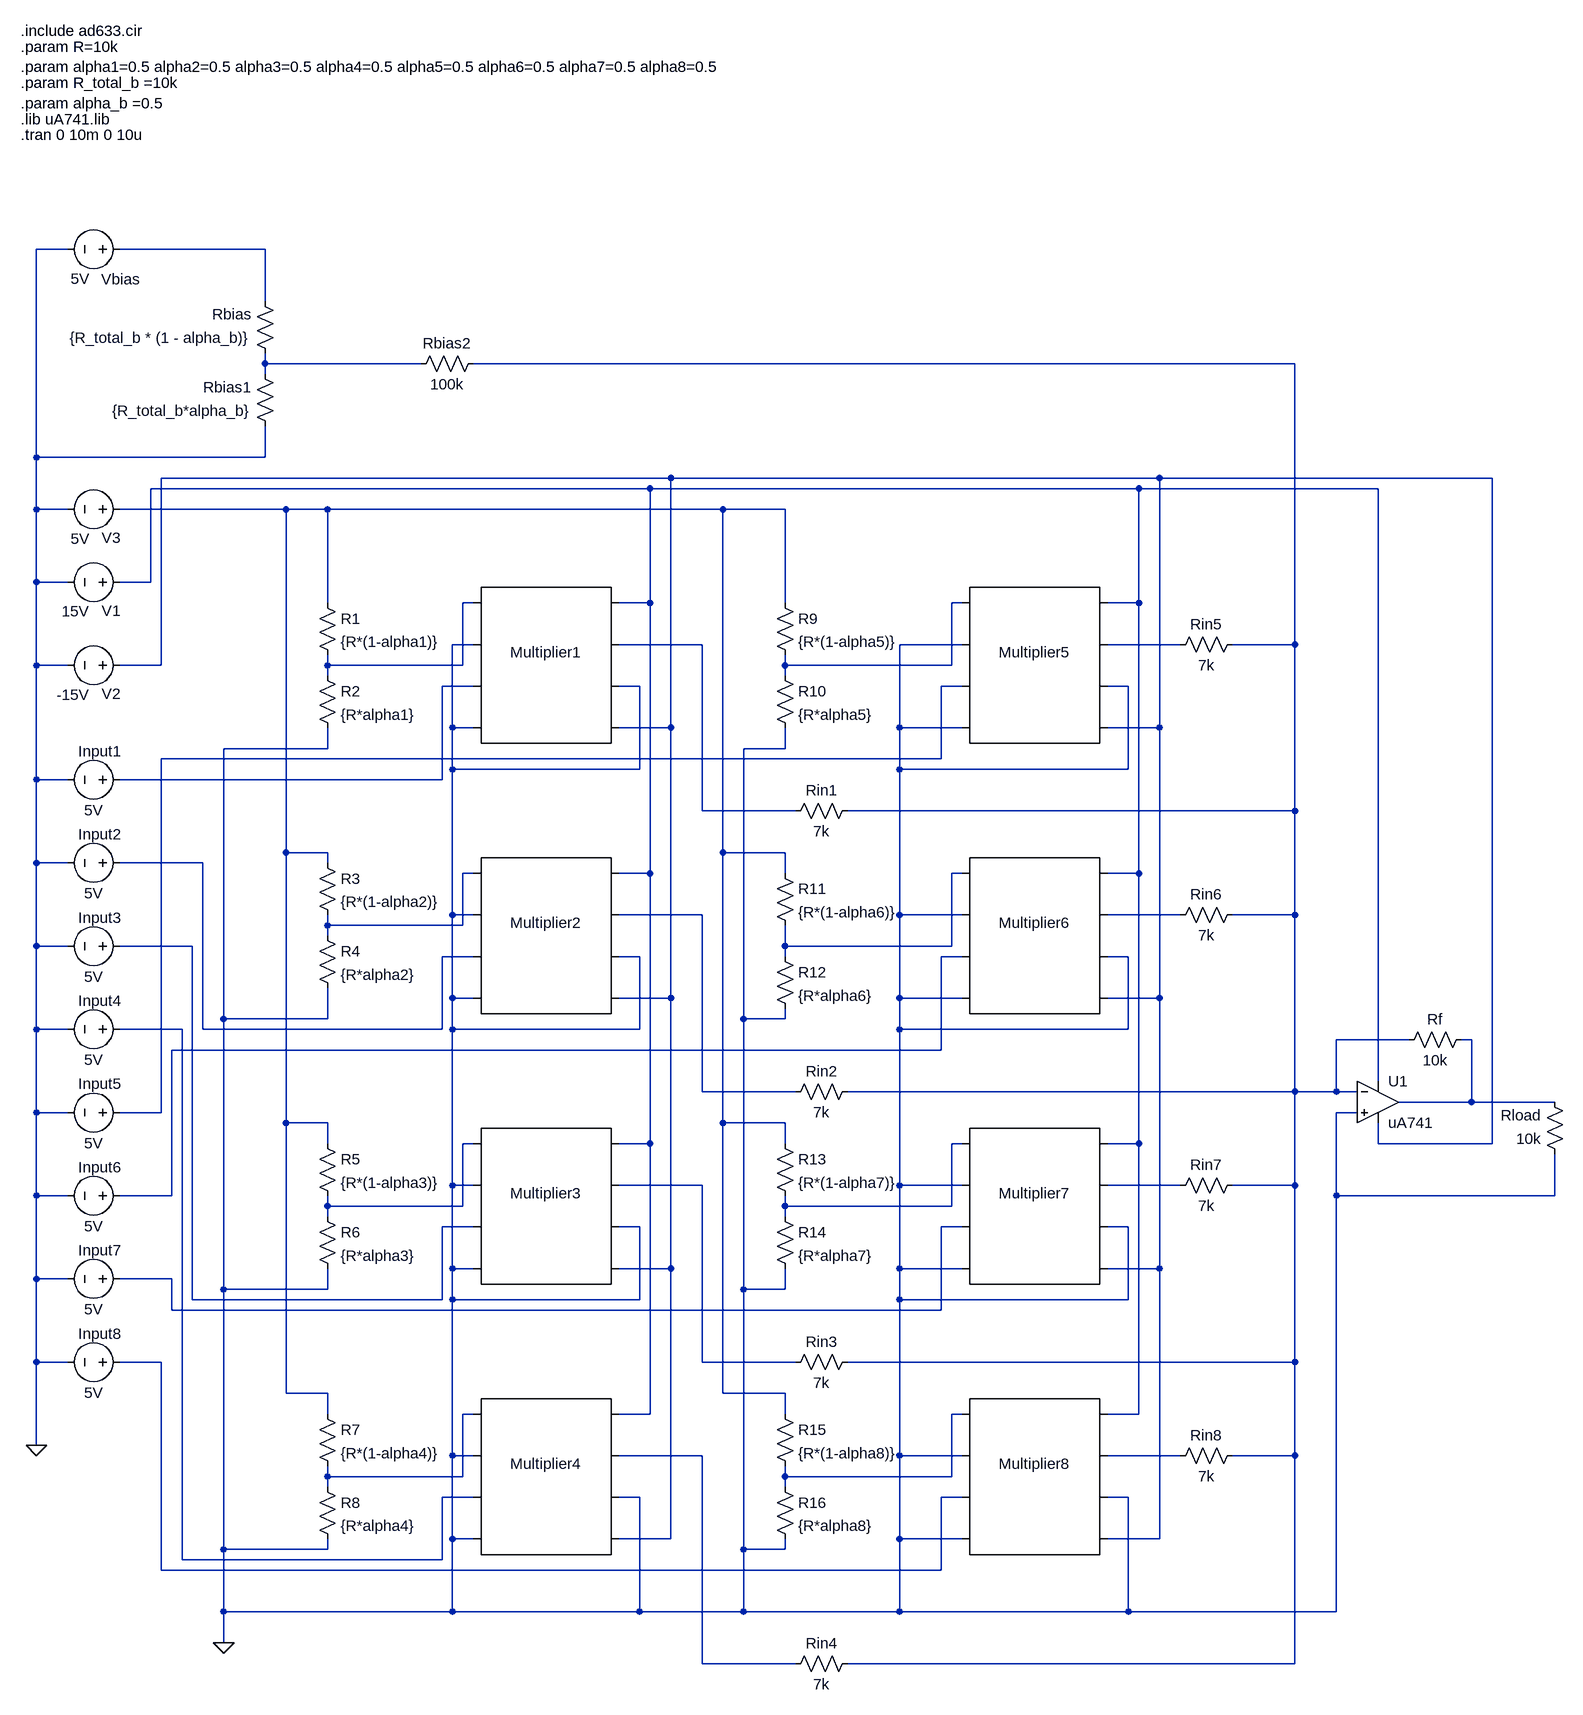
[diagram p0: schematic NMcircuit.asc]
NMcircuit.asc, the LTspice schematic file:
Version 4
SHEET 1 2036 1800
WIRE -272 -448 -320 -448
WIRE 32 -448 -192 -448
WIRE 32 -368 32 -448
WIRE 32 -272 32 -288
WIRE 272 -272 32 -272
WIRE 1616 -272 352 -272
WIRE 32 -256 32 -272
WIRE -320 -128 -320 -448
WIRE 32 -128 32 -176
WIRE 32 -128 -320 -128
WIRE 656 -96 -128 -96
WIRE 1408 -96 656 -96
WIRE 1920 -96 1408 -96
WIRE 624 -80 -144 -80
WIRE 1376 -80 624 -80
WIRE 1744 -80 1376 -80
WIRE -320 -48 -320 -128
WIRE -272 -48 -320 -48
WIRE 64 -48 -192 -48
WIRE 128 -48 64 -48
WIRE 736 -48 128 -48
WIRE 832 -48 736 -48
WIRE -320 64 -320 -48
WIRE -272 64 -320 64
WIRE -144 64 -144 -80
WIRE -144 64 -192 64
WIRE 128 96 128 -48
WIRE 352 96 336 96
WIRE 624 96 624 -80
WIRE 624 96 576 96
WIRE 832 96 832 -48
WIRE 1104 96 1088 96
WIRE 1376 96 1376 -80
WIRE 1376 96 1328 96
WIRE 352 160 320 160
WIRE 704 160 576 160
WIRE 1104 160 1008 160
WIRE 1440 160 1328 160
WIRE 1616 160 1616 -272
WIRE 1616 160 1520 160
WIRE -320 192 -320 64
WIRE -272 192 -320 192
WIRE -128 192 -128 -96
WIRE -128 192 -192 192
WIRE 128 192 128 176
WIRE 336 192 336 96
WIRE 336 192 128 192
WIRE 832 192 832 176
WIRE 1088 192 1088 96
WIRE 1088 192 832 192
WIRE 128 208 128 192
WIRE 832 208 832 192
WIRE 352 224 304 224
WIRE 608 224 576 224
WIRE 1104 224 1072 224
WIRE 1360 224 1328 224
WIRE 320 288 320 160
WIRE 352 288 320 288
WIRE 656 288 656 -96
WIRE 656 288 576 288
WIRE 1008 288 1008 160
WIRE 1104 288 1008 288
WIRE 1408 288 1408 -96
WIRE 1408 288 1328 288
WIRE 128 320 128 288
WIRE 128 320 -32 320
WIRE 832 320 832 288
WIRE 832 320 768 320
WIRE 1072 336 1072 224
WIRE 1072 336 -128 336
WIRE 320 352 320 288
WIRE 608 352 608 224
WIRE 608 352 320 352
WIRE 1008 352 1008 288
WIRE 1360 352 1360 224
WIRE 1360 352 1008 352
WIRE -320 368 -320 192
WIRE -272 368 -320 368
WIRE 304 368 304 224
WIRE 304 368 -192 368
WIRE 704 416 704 160
WIRE 848 416 704 416
WIRE 1616 416 1616 160
WIRE 1616 416 928 416
WIRE 64 480 64 -48
WIRE 128 480 64 480
WIRE 736 480 736 -48
WIRE 832 480 736 480
WIRE -320 496 -320 368
WIRE -272 496 -320 496
WIRE -64 496 -192 496
WIRE 128 496 128 480
WIRE 352 512 336 512
WIRE 624 512 624 96
WIRE 624 512 576 512
WIRE 832 512 832 480
WIRE 1104 512 1088 512
WIRE 1376 512 1376 96
WIRE 1376 512 1328 512
WIRE 320 576 320 352
WIRE 352 576 320 576
WIRE 704 576 576 576
WIRE 1008 576 1008 352
WIRE 1104 576 1008 576
WIRE 1440 576 1328 576
WIRE 1616 576 1616 416
WIRE 1616 576 1520 576
WIRE 128 592 128 576
WIRE 336 592 336 512
WIRE 336 592 128 592
WIRE 128 608 128 592
WIRE -320 624 -320 496
WIRE -272 624 -320 624
WIRE -80 624 -192 624
WIRE 832 624 832 592
WIRE 1088 624 1088 512
WIRE 1088 624 832 624
WIRE 352 640 304 640
WIRE 608 640 576 640
WIRE 832 640 832 624
WIRE 1104 640 1072 640
WIRE 1360 640 1328 640
WIRE 320 704 320 576
WIRE 352 704 320 704
WIRE 656 704 656 288
WIRE 656 704 576 704
WIRE 1008 704 1008 576
WIRE 1104 704 1008 704
WIRE 1408 704 1408 288
WIRE 1408 704 1328 704
WIRE -32 736 -32 320
WIRE 128 736 128 688
WIRE 128 736 -32 736
WIRE 768 736 768 320
WIRE 832 736 832 720
WIRE 832 736 768 736
WIRE -320 752 -320 624
WIRE -272 752 -320 752
WIRE -96 752 -192 752
WIRE -64 752 -64 496
WIRE 304 752 304 640
WIRE 304 752 -64 752
WIRE 320 752 320 704
WIRE 608 752 608 640
WIRE 608 752 320 752
WIRE 1008 752 1008 704
WIRE 1360 752 1360 640
WIRE 1360 752 1008 752
WIRE 1792 768 1680 768
WIRE 1888 768 1872 768
WIRE 1072 784 1072 640
WIRE 1072 784 -112 784
WIRE 1744 832 1744 -80
WIRE 704 848 704 576
WIRE 848 848 704 848
WIRE 1616 848 1616 576
WIRE 1616 848 928 848
WIRE 1680 848 1680 768
WIRE 1680 848 1616 848
WIRE 1712 848 1680 848
WIRE 1888 864 1888 768
WIRE 1888 864 1776 864
WIRE 2016 864 1888 864
WIRE -320 880 -320 752
WIRE -272 880 -320 880
WIRE -128 880 -128 336
WIRE -128 880 -192 880
WIRE 1712 880 1680 880
WIRE 64 896 64 480
WIRE 128 896 64 896
WIRE 736 896 736 480
WIRE 832 896 736 896
WIRE 128 928 128 896
WIRE 352 928 336 928
WIRE 624 928 624 512
WIRE 624 928 576 928
WIRE 832 928 832 896
WIRE 1104 928 1088 928
WIRE 1376 928 1376 512
WIRE 1376 928 1328 928
WIRE 1744 928 1744 896
WIRE 1920 928 1920 -96
WIRE 1920 928 1744 928
WIRE 320 992 320 752
WIRE 352 992 320 992
WIRE 704 992 576 992
WIRE 1008 992 1008 752
WIRE 1104 992 1008 992
WIRE 1440 992 1328 992
WIRE 1616 992 1616 848
WIRE 1616 992 1520 992
WIRE -320 1008 -320 880
WIRE -272 1008 -320 1008
WIRE -112 1008 -112 784
WIRE -112 1008 -192 1008
WIRE 1680 1008 1680 880
WIRE 2016 1008 2016 944
WIRE 2016 1008 1680 1008
WIRE 128 1024 128 1008
WIRE 336 1024 336 928
WIRE 336 1024 128 1024
WIRE 832 1024 832 1008
WIRE 1088 1024 1088 928
WIRE 1088 1024 832 1024
WIRE 128 1040 128 1024
WIRE 832 1040 832 1024
WIRE 352 1056 304 1056
WIRE 608 1056 576 1056
WIRE 1104 1056 1072 1056
WIRE 1360 1056 1328 1056
WIRE 320 1120 320 992
WIRE 352 1120 320 1120
WIRE 656 1120 656 704
WIRE 656 1120 576 1120
WIRE 1008 1120 1008 992
WIRE 1104 1120 1008 1120
WIRE 1408 1120 1408 704
WIRE 1408 1120 1328 1120
WIRE -320 1136 -320 1008
WIRE -272 1136 -320 1136
WIRE -112 1136 -192 1136
WIRE -32 1152 -32 736
WIRE 128 1152 128 1120
WIRE 128 1152 -32 1152
WIRE 768 1152 768 736
WIRE 832 1152 832 1120
WIRE 832 1152 768 1152
WIRE -80 1168 -80 624
WIRE 304 1168 304 1056
WIRE 304 1168 -80 1168
WIRE 320 1168 320 1120
WIRE 608 1168 608 1056
WIRE 608 1168 320 1168
WIRE 1008 1168 1008 1120
WIRE 1360 1168 1360 1056
WIRE 1360 1168 1008 1168
WIRE -112 1184 -112 1136
WIRE 1072 1184 1072 1056
WIRE 1072 1184 -112 1184
WIRE -320 1264 -320 1136
WIRE -272 1264 -320 1264
WIRE -128 1264 -192 1264
WIRE 704 1264 704 992
WIRE 848 1264 704 1264
WIRE 1616 1264 1616 992
WIRE 1616 1264 928 1264
WIRE 64 1312 64 896
WIRE 128 1312 64 1312
WIRE 736 1312 736 896
WIRE 832 1312 736 1312
WIRE 128 1344 128 1312
WIRE 352 1344 336 1344
WIRE 624 1344 624 928
WIRE 624 1344 576 1344
WIRE 832 1344 832 1312
WIRE 1104 1344 1088 1344
WIRE 1376 1344 1376 928
WIRE 1376 1344 1328 1344
WIRE -320 1392 -320 1264
WIRE 320 1408 320 1168
WIRE 352 1408 320 1408
WIRE 704 1408 576 1408
WIRE 1008 1408 1008 1168
WIRE 1104 1408 1008 1408
WIRE 1440 1408 1328 1408
WIRE 1616 1408 1616 1264
WIRE 1616 1408 1520 1408
WIRE 128 1440 128 1424
WIRE 336 1440 336 1344
WIRE 336 1440 128 1440
WIRE 832 1440 832 1424
WIRE 1088 1440 1088 1344
WIRE 1088 1440 832 1440
WIRE 128 1456 128 1440
WIRE 832 1456 832 1440
WIRE 352 1472 304 1472
WIRE 608 1472 576 1472
WIRE 1104 1472 1072 1472
WIRE 1360 1472 1328 1472
WIRE 320 1536 320 1408
WIRE 352 1536 320 1536
WIRE 656 1536 656 1120
WIRE 656 1536 576 1536
WIRE 1008 1536 1008 1408
WIRE 1104 1536 1008 1536
WIRE 1408 1536 1408 1120
WIRE 1408 1536 1328 1536
WIRE -32 1552 -32 1152
WIRE 128 1552 128 1536
WIRE 128 1552 -32 1552
WIRE 768 1552 768 1152
WIRE 832 1552 832 1536
WIRE 832 1552 768 1552
WIRE -96 1568 -96 752
WIRE 304 1568 304 1472
WIRE 304 1568 -96 1568
WIRE -128 1584 -128 1264
WIRE 1072 1584 1072 1472
WIRE 1072 1584 -128 1584
WIRE -32 1648 -32 1552
WIRE 320 1648 320 1536
WIRE 320 1648 -32 1648
WIRE 608 1648 608 1472
WIRE 608 1648 320 1648
WIRE 768 1648 768 1552
WIRE 768 1648 608 1648
WIRE 1008 1648 1008 1536
WIRE 1008 1648 768 1648
WIRE 1360 1648 1360 1472
WIRE 1360 1648 1008 1648
WIRE 1680 1648 1680 1008
WIRE 1680 1648 1360 1648
WIRE -32 1696 -32 1648
WIRE 704 1728 704 1408
WIRE 848 1728 704 1728
WIRE 1616 1728 1616 1408
WIRE 1616 1728 928 1728
FLAG -320 1392 0
FLAG -32 1696 0
SYMBOL voltage -176 64 R90
WINDOW 0 44 14 VRight 2
WINDOW 3 45 62 VRight 2
WINDOW 123 0 0 Left 0
WINDOW 39 0 0 Left 0
SYMATTR InstName V1
SYMATTR Value 15V
SYMBOL voltage -176 -48 R90
WINDOW 0 44 14 VRight 2
WINDOW 3 45 62 VRight 2
WINDOW 123 0 0 Left 0
WINDOW 39 0 0 Left 0
SYMATTR InstName V3
SYMATTR Value 5V
SYMBOL Misc\\DIP8 464 192 R0
SYMATTR InstName Multiplier1
SYMATTR SpiceModel ad633
SYMBOL Misc\\DIP8 464 608 R0
SYMATTR InstName Multiplier2
SYMATTR SpiceModel ad633
SYMBOL Misc\\DIP8 464 1024 R0
SYMATTR InstName Multiplier3
SYMATTR SpiceModel ad633
SYMBOL Misc\\DIP8 464 1440 R0
SYMATTR InstName Multiplier4
SYMATTR SpiceModel ad633
SYMBOL Misc\\DIP8 1216 192 R0
SYMATTR InstName Multiplier5
SYMATTR SpiceModel ad633
SYMBOL Misc\\DIP8 1216 608 R0
SYMATTR InstName Multiplier6
SYMATTR SpiceModel ad633
SYMBOL Misc\\DIP8 1216 1024 R0
SYMATTR InstName Multiplier7
SYMATTR SpiceModel ad633
SYMBOL Misc\\DIP8 1216 1440 R0
SYMATTR InstName Multiplier8
SYMATTR SpiceModel ad633
SYMBOL res 112 80 R0
SYMATTR InstName R1
SYMATTR Value {R*(1-alpha1)}
SYMBOL res 112 192 R0
SYMATTR InstName R2
SYMATTR Value {R*alpha1}
SYMBOL res 112 480 R0
SYMATTR InstName R3
SYMATTR Value {R*(1-alpha2)}
SYMBOL res 112 592 R0
SYMATTR InstName R4
SYMATTR Value {R*alpha2}
SYMBOL res 112 912 R0
SYMATTR InstName R5
SYMATTR Value {R*(1-alpha3)}
SYMBOL res 112 1024 R0
SYMATTR InstName R6
SYMATTR Value {R*alpha3}
SYMBOL res 112 1328 R0
SYMATTR InstName R7
SYMATTR Value {R*(1-alpha4)}
SYMBOL res 112 1440 R0
SYMATTR InstName R8
SYMATTR Value {R*alpha4}
SYMBOL res 816 80 R0
SYMATTR InstName R9
SYMATTR Value {R*(1-alpha5)}
SYMBOL res 816 192 R0
SYMATTR InstName R10
SYMATTR Value {R*alpha5}
SYMBOL res 816 496 R0
SYMATTR InstName R11
SYMATTR Value {R*(1-alpha6)}
SYMBOL res 816 624 R0
SYMATTR InstName R12
SYMATTR Value {R*alpha6}
SYMBOL res 816 912 R0
SYMATTR InstName R13
SYMATTR Value {R*(1-alpha7)}
SYMBOL res 816 1024 R0
SYMATTR InstName R14
SYMATTR Value {R*alpha7}
SYMBOL res 816 1328 R0
SYMATTR InstName R15
SYMATTR Value {R*(1-alpha8)}
SYMBOL res 816 1440 R0
SYMATTR InstName R16
SYMATTR Value {R*alpha8}
SYMBOL res 944 400 R90
WINDOW 0 0 56 VBottom 2
WINDOW 3 32 56 VTop 2
SYMATTR InstName Rin1
SYMATTR Value 7k
SYMBOL res 944 832 R90
WINDOW 0 0 56 VBottom 2
WINDOW 3 32 56 VTop 2
SYMATTR InstName Rin2
SYMATTR Value 7k
SYMBOL res 944 1248 R90
WINDOW 0 0 56 VBottom 2
WINDOW 3 32 56 VTop 2
SYMATTR InstName Rin3
SYMATTR Value 7k
SYMBOL res 944 1712 R90
WINDOW 0 0 56 VBottom 2
WINDOW 3 32 56 VTop 2
SYMATTR InstName Rin4
SYMATTR Value 7k
SYMBOL res 1536 144 R90
WINDOW 0 0 56 VBottom 2
WINDOW 3 32 56 VTop 2
SYMATTR InstName Rin5
SYMATTR Value 7k
SYMBOL res 1536 560 R90
WINDOW 0 0 56 VBottom 2
WINDOW 3 32 56 VTop 2
SYMATTR InstName Rin6
SYMATTR Value 7k
SYMBOL res 1536 976 R90
WINDOW 0 0 56 VBottom 2
WINDOW 3 32 56 VTop 2
SYMATTR InstName Rin7
SYMATTR Value 7k
SYMBOL res 1536 1392 R90
WINDOW 0 0 56 VBottom 2
WINDOW 3 32 56 VTop 2
SYMATTR InstName Rin8
SYMATTR Value 7k
SYMBOL res 1888 752 R90
WINDOW 0 0 56 VBottom 2
WINDOW 3 32 56 VTop 2
SYMATTR InstName Rf
SYMATTR Value 10k
SYMBOL res 48 -272 R180
WINDOW 0 36 76 Left 2
WINDOW 3 36 40 Left 2
SYMATTR InstName Rbias
SYMATTR Value {R_total_b * (1 - alpha_b)}
SYMBOL voltage -176 368 R90
WINDOW 0 -44 12 VRight 2
WINDOW 3 47 41 VRight 2
WINDOW 123 0 0 Left 0
WINDOW 39 0 0 Left 0
SYMATTR InstName Input1
SYMATTR Value 5V
SYMBOL voltage -176 496 R90
WINDOW 0 -44 12 VRight 2
WINDOW 3 47 41 VRight 2
WINDOW 123 0 0 Left 0
WINDOW 39 0 0 Left 0
SYMATTR InstName Input2
SYMATTR Value 5V
SYMBOL voltage -176 624 R90
WINDOW 0 -44 12 VRight 2
WINDOW 3 47 41 VRight 2
WINDOW 123 0 0 Left 0
WINDOW 39 0 0 Left 0
SYMATTR InstName Input3
SYMATTR Value 5V
SYMBOL voltage -176 752 R90
WINDOW 0 -44 12 VRight 2
WINDOW 3 47 41 VRight 2
WINDOW 123 0 0 Left 0
WINDOW 39 0 0 Left 0
SYMATTR InstName Input4
SYMATTR Value 5V
SYMBOL voltage -176 880 R90
WINDOW 0 -44 12 VRight 2
WINDOW 3 47 41 VRight 2
WINDOW 123 0 0 Left 0
WINDOW 39 0 0 Left 0
SYMATTR InstName Input5
SYMATTR Value 5V
SYMBOL voltage -176 1008 R90
WINDOW 0 -44 12 VRight 2
WINDOW 3 47 41 VRight 2
WINDOW 123 0 0 Left 0
WINDOW 39 0 0 Left 0
SYMATTR InstName Input6
SYMATTR Value 5V
SYMBOL voltage -176 1136 R90
WINDOW 0 -44 12 VRight 2
WINDOW 3 47 41 VRight 2
WINDOW 123 0 0 Left 0
WINDOW 39 0 0 Left 0
SYMATTR InstName Input7
SYMATTR Value 5V
SYMBOL voltage -176 1264 R90
WINDOW 0 -44 12 VRight 2
WINDOW 3 47 41 VRight 2
WINDOW 123 0 0 Left 0
WINDOW 39 0 0 Left 0
SYMATTR InstName Input8
SYMATTR Value 5V
SYMBOL voltage -176 -448 R90
WINDOW 0 46 -16 VRight 2
WINDOW 3 45 62 VRight 2
WINDOW 123 0 0 Left 0
WINDOW 39 0 0 Left 0
SYMATTR InstName Vbias
SYMATTR Value 5V
SYMBOL res 2032 960 R180
WINDOW 0 36 76 Left 2
WINDOW 3 36 40 Left 2
SYMATTR InstName Rload
SYMATTR Value 10k
SYMBOL voltage -176 192 R90
WINDOW 0 44 14 VRight 2
WINDOW 3 45 62 VRight 2
WINDOW 123 0 0 Left 0
WINDOW 39 0 0 Left 0
SYMATTR InstName V2
SYMATTR Value -15V
SYMBOL OpAmps\\opamp2 1744 800 R0
SYMATTR InstName U1
SYMATTR Value uA741
SYMBOL res 48 -160 R180
WINDOW 0 36 76 Left 2
WINDOW 3 36 40 Left 2
SYMATTR InstName Rbias1
SYMATTR Value {R_total_b*alpha_b}
SYMBOL res 256 -256 R270
WINDOW 0 32 56 VTop 2
WINDOW 3 0 56 VBottom 2
SYMATTR InstName Rbias2
SYMATTR Value 100k
TEXT -344 -784 Left 2 !.include ad633.cir
TEXT -344 -760 Left 2 !.param R=10k\n.param alpha1=0.5 alpha2=0.5 alpha3=0.5 alpha4=0.5 alpha5=0.5 alpha6=0.5 alpha7=0.5 alpha8=0.5
TEXT -344 -624 Left 2 !.tran 0 10m 0 10u
TEXT -344 -648 Left 2 !.lib uA741.lib
TEXT -344 -704 Left 2 !.param R_total_b =10k\n.param alpha_b =0.5

The netlist it stands for:
* NMcircuit.asc
V1 N005 0 15V
V3 N006 0 5V
XMultiplier1 N007 0 N011 0 N004 0 N009 N005 ad633
XMultiplier2 N014 0 N013 0 N004 0 N016 N005 ad633
XMultiplier3 N022 0 N018 0 N004 0 N024 N005 ad633
XMultiplier4 N028 0 N020 0 N004 0 N030 N005 ad633
XMultiplier5 N008 0 N012 0 N004 0 N010 N005 ad633
XMultiplier6 N015 0 N019 0 N004 0 N017 N005 ad633
XMultiplier7 N023 0 N026 0 N004 0 N025 N005 ad633
XMultiplier8 N029 0 N027 0 N004 0 N031 N005 ad633
R1 N006 N007 {R*(1-alpha1)}
R2 N007 0 {R*alpha1}
R3 N006 N014 {R*(1-alpha2)}
R4 N014 0 {R*alpha2}
R5 N006 N022 {R*(1-alpha3)}
R6 N022 0 {R*alpha3}
R7 N006 N028 {R*(1-alpha4)}
R8 N028 0 {R*alpha4}
R9 N006 N008 {R*(1-alpha5)}
R10 N008 0 {R*alpha5}
R11 N006 N015 {R*(1-alpha6)}
R12 N015 0 {R*alpha6}
R13 N006 N023 {R*(1-alpha7)}
R14 N023 0 {R*alpha7}
R15 N006 N029 {R*(1-alpha8)}
R16 N029 0 {R*alpha8}
Rin1 N003 N009 7k
Rin2 N003 N016 7k
Rin3 N003 N024 7k
Rin4 N003 N030 7k
Rin5 N003 N010 7k
Rin6 N003 N017 7k
Rin7 N003 N025 7k
Rin8 N003 N031 7k
Rf N021 N003 10k
Rbias N002 N001 {R_total_b * (1 - alpha_b)}
V§Input1 N011 0 5V
V§Input2 N013 0 5V
V§Input3 N018 0 5V
V§Input4 N020 0 5V
V§Input5 N012 0 5V
V§Input6 N019 0 5V
V§Input7 N026 0 5V
V§Input8 N027 0 5V
Vbias N001 0 5V
Rload 0 N021 10k
V2 N004 0 -15V
XU1 0 N003 N005 N004 N021 uA741  ; pins In+ In- V+ V- OUT
Rbias1 0 N002 {R_total_b*alpha_b}
Rbias2 N002 N003 100k
.include ad633.cir
.param R=10k
.param alpha1=0.5 alpha2=0.5 alpha3=0.5 alpha4=0.5 alpha5=0.5 alpha6=0.5 alpha7=0.5 alpha8=0.5
.tran 0 10m 0 10u
.lib uA741.lib
.param R_total_b =10k
.param alpha_b =0.5
.backanno
.end